# Altium schematic sheet MSC.SchDoc: MSC
size A4; Revision: Rev A; SheetNumber: 2; SheetTotal: 3
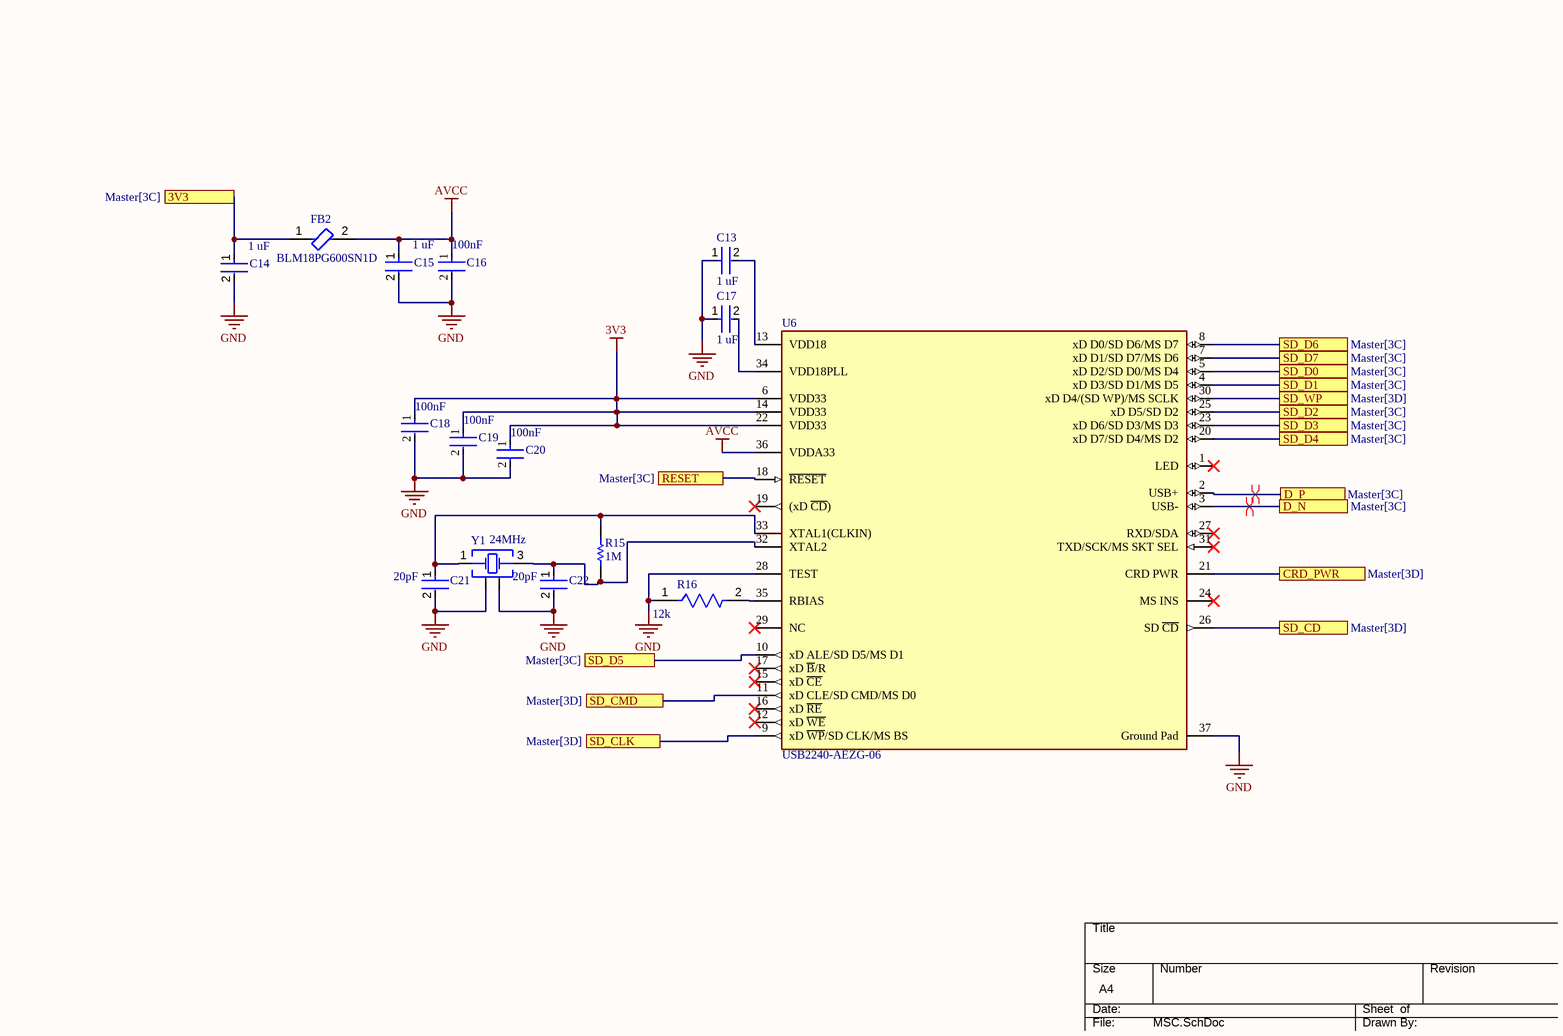
[diagram p0: MSC.SchDoc]

## Parts
C13  value 1 uF  [FP-CC0603-DA-MFG]  (hidden comment: CC0603KRX7R7BB105)
C14  value 1 uF  [FP-CC0603-DA-MFG]  (hidden comment: CC0603KRX7R7BB105)
C15  value 1 uF  [FP-CC0603-DA-MFG]  (hidden comment: CC0603KRX7R7BB105)
C16  Capacitance: 100nF  [FP-GRM155-0_05-MFG]  (hidden comment: GRM155R71C104KA88J)
C17  value 1 uF  [FP-CC0603-DA-MFG]  (hidden comment: CC0603KRX7R7BB105)
C18  Capacitance: 100nF  [FP-GRM155-0_05-MFG]  (hidden comment: GRM155R71C104KA88J)
C19  Capacitance: 100nF  [FP-GRM155-0_05-MFG]  (hidden comment: GRM155R71C104KA88J)
C20  Capacitance: 100nF  [FP-GRM155-0_05-MFG]  (hidden comment: GRM155R71C104KA88J)
C21  value 20pF  [FP-GJM033-0_03-IPC_A]  (hidden comment: GJM0335C1E200FB01D)
C22  value 20pF  [FP-GJM033-0_03-IPC_A]  (hidden comment: GJM0335C1E200FB01D)
FB2  BLM18PG600SN1D  [FP-BLM18-0_15-t0_8-IPC_B]
R15  1M  [RESC1608X55X25LL10T15]
R16  Resistance: 12k  [FP-RMCF0603-IPC_C]  (hidden comment: RMCF0603FT12K0)
U6  USB2240-AEZG-06  [FP-36QFN-4106-6x6B-MFG]
Y1  Frequency: 24MHz  [WE-XTAL_CFPX-180]  (hidden comment: 830035266)

## Ports
3V3 (see Master[3C]), CRD_PWR (see Master[3D]), D_N (see Master[3C]), D_P (see Master[3C]), RESET (see Master[3C]), SD_CD (see Master[3D]), SD_CLK (see Master[3D]), SD_CMD (see Master[3D]), SD_D0 (see Master[3C]), SD_D1 (see Master[3C]), SD_D2 (see Master[3C]), SD_D3 (see Master[3C]), SD_D4 (see Master[3C]), SD_D5 (see Master[3C]), SD_D6 (see Master[3C]), SD_D7 (see Master[3C]), SD_WP (see Master[3D])

## Nets
3V3: C18.1 C19.1 C20.1 U6.6(VDD33) U6.14(VDD33) U6.22(VDD33)
AVCC: C15.1 C16.1 FB2.2 U6.36(VDDA33)
GND: C13.1 C14.2 C15.2 C16.2 C17.1 C18.2 C19.2 C20.2 C21.2 C22.2 R16.1 U6.28(TEST) U6.37(Ground_Pad) Y1.2(GND&Lid) Y1.4(GND&Lid)
3V3: C14.1 FB2.1 ; port 3V3  [a separate net that carries the same name]
CRD_PWR: U6.21(CRD_PWR) ; port CRD_PWR
D_N: U6.3(USB-) ; port D_N
D_P: U6.2(USB+) ; port D_P
RESET: U6.18(~{RESET}) ; port RESET
SD_CD: U6.26(SD_~{CD}) ; port SD_CD
SD_CLK: U6.9(xD_~{WP}/SD_CLK/MS_BS) ; port SD_CLK
SD_CMD: U6.11(xD_CLE/SD_CMD/MS_D0) ; port SD_CMD
SD_D0: U6.5(xD_D2/SD_D0/MS_D4) ; port SD_D0
SD_D1: U6.4(xD_D3/SD_D1/MS_D5) ; port SD_D1
SD_D2: U6.25(xD_D5/SD_D2) ; port SD_D2
SD_D3: U6.23(xD_D6/SD_D3/MS_D3) ; port SD_D3
SD_D4: U6.20(xD_D7/SD_D4/MS_D2) ; port SD_D4
SD_D5: U6.10(xD_ALE/SD_D5/MS_D1) ; port SD_D5
SD_D6: U6.8(xD_D0/SD_D6/MS_D7) ; port SD_D6
SD_D7: U6.7(xD_D1/SD_D7/MS_D6) ; port SD_D7
SD_WP: U6.30(xD_D4/(SD_WP)/MS_SCLK) ; port SD_WP
NetC13_2: C13.2 U6.13(VDD18)
NetC17_2: C17.2 U6.34(VDD18PLL)
NetC21_1: C21.1 R15.1 U6.33(XTAL1(CLKIN)) Y1.1(Crystal)
NetC22_1: C22.1 R15.2 U6.32(XTAL2) Y1.3(Crystal)
NetR16_2: R16.2 U6.35(RBIAS)

Not connected (* = marked no-connect by the designer): U6 1(LED)* 12(xD_~{WE})* 15(xD_~{CE})* 16(xD_~{RE})* 17(xD_~{B}/R)* 19((xD_~{CD}))* 24(MS_INS)* 27(RXD/SDA)* 29(NC)* 31(TXD/SCK/MS_SKT_SEL)*

## Layout directives
differential pair: D_N, D_P

## Notes on the sheet
- THIS DOCUMENT AND THE DATA DISCLOSED HEREIN OR
- HEREWITH IS THE PROPERTY OF ALTIUM LIMITED AND MAY
- DWG NO:
- REVISION
- REV:
- DESCRIPTION
- DATE
- APPROVED
- BE FREELY DISTRIBUTED IN WHOLE. NO RIGHTS ARE
- RESERVED OR EXPRESS OR IMPLIED WARANTEE GIVEN.
- ENG:
- APPROVALS
- PROJECT
- DSN:
- CHK:
- REFERENCE DOCUMENTS
- PROJECT REVISION:
- TITLE
- DOCUMENT REVISION:
- DESIGN ITEM:
- BOM:
- FAB DWG:
- PCB DWG:
- ASSY DWG:
- SCALE:
- A3
- SIZE
- CAGE CODE
- FILE NAME
- DWG NO.
- SHEET
- OF
- REV

## Library data of the parts
C13-C15 C17 = CMP-03422-000924-1: CAP CER 1UF 16V X7R 0603; Manufacturer: YAGEO; Tolerance: 0.1; Temperature Coefficient: 15%; Material: Ceramic; Package: CC0603-DA; RoHS: TRUE; Device Class L2: Capacitors; Temperature Characteristic: X7R; Temperature: -55°C to +125°C; Temperature Range Low: -55°C; Automotive: No; ComponentLink2Description: Datasheet; Lead Free: Yes; Capacitance: 1 uF; ComponentLink2URL: http://www.yageo.com/documents/recent/UPY-GPHC_X7R_6.3V-to-50V_18.pdf; Device Class L1: Passive Components; Voltage: 16 V; Octopart: https://octopart.com/cc0603krx7r7bb105-yageo-42271928; Category: Cap; Digikey Description: CAP CER 1UF 16V X7R 0603; Footprint Url: http://www.yageo.com/exep/pages/download/literatures/UPY-C_GEN_24.pdf; Height: 0.9mm; Manufacturer Part Number: CC0603KRX7R7BB105; Voltage Rating: 16 V; Temperature Range High: +125°C; Mouser Description: Multilayer Ceramic Capacitor, CC Series, 1 - F, - 10%, X7R, 16 V, 0603 [1608 Metric]; Device Class L3: Ceramic Capacitors
C16 C18-C20 = CMP-2008-03928-2: NexarPartId: 9223238; Manufacturer Lifecycle Status: NRND; Voltage: 16V; Tolerance: 10%; Dielectric: X7R; Material: Ceramic; Schedule B: 8532240020, 8532240020; Mount: Surface Mount; Case/Package: 0402; Case Code (Imperial): 0402; Min Operating Temperature: -55°C; Length: 1mm; Voltage Rating (DC): 16V; Depth: 500µm; Lead Free: Lead Free; Max Operating Temperature: 125°C; Case Code (Metric): 1005; Radiation Hardening: No; Height: 550µm; Voltage Rating: 16V; Packaging: Cut Tape; RoHS: Compliant; Width: 500µm; Number of Pins: 2; REACH SVHC: No SVHC; Termination: SMD/SMT; Thickness: 500µm
C21 C22 = CMP-06035-050874-1: Ceramic Capacitor 20pF ±1% 25V C0G 0201 (0603 Metric)
FB2 = CMP-0686-00575-3: Chip Ferrite Bead, 0603, 60Ω @ 100MHz, 0.1Ω, , 1A; ESR (Equivalent Series Resistance): 60R; Number of Lines: 1; Material: Steel; Tolerance: 25%; Shielding: Unshielded; Current Rating: 500mA; Resistance: 100mR; Package Quantity: 1; Termination: SMD/SMT; Lead Free: Lead Free; Max Operating Temperature: 125°C; Number of Circuits: 1; Length: 1.6mm; Min Operating Temperature: -55°C; Case Code (Metric): 1608; Max DC Current: 500mA; REACH SVHC: No SVHC; Frequency: 100MHz; Number of Pins: 2; RoHS Compliant: Yes; Height: 0.8mm; Depth: 0.8mm; Width: 0.8mm; Test Frequency: 100MHz; Case/Package: 0603; Impedance: 60R; Max Current Rating: 500mA; Packaging: Tape and Reel; DC Resistance (DCR): 100mR; Case Code (Imperial): 0603; Core Material: Ferrite
R15 = CMP-1659-00056-1: Chip Resistor, 1 MOhm, +/- 1%, 100 mW, -55 to 155 degC, 0603 (1608 Metric), RoHS, Tape and Reel; Voltage Rating (DC): 25 V; Tolerance: 20%; Case\Package: Radial; Capacitance: 1 mF; Min Operating Temperature: -40 degC; PackageDescription: 2-Pin Surface Mount Device, Body 1.6 x 0.8 mm; ComponentLink1Description: Manufacturer URL; Radiation Hardening: No; DatasheetVersion: Rev. 4, 02/2016; REACH SVHC: No SVHC; Length: 20 mm; Max Operating Temperature: 85 degC; Diameter: 10 mm; Packaging: Bulk; Package Quantity: 200; PackageReference: 0603; Mount: Through Hole; ComponentLink1URL: http://www.yageo.com/; ComponentLink2URL: http://www.yageo.com/documents/recent/PYu-RC_Group_51_RoHS_L_04.pdf; ComponentLink2Description: Datasheet; Width: 0 inch; Lead Pitch: 5 mm; RoHSCompliant: true; Voltage Rating: 25 V; Height: 20 mm
R16 = CMP-26527-001326-1: 12kΩ ±1% 0.1W 0603 Thick Film Chip Resistor AEC-Q200 compliant; Temperature Coefficient: 100ppm/°C; Max Power Dissipation: 100mW; Lead Free: Lead Free; Case Code (Metric): 1608; Features: Automotive AEC-Q200; Length: 0.061inch; Radiation Hardening: No; Size Code: 0603; Mount: Surface Mount; Series: RMCF; Width: 0.031inch; Tolerance: 1%; Case Code (Imperial): 0603; Case/Package: 0603; Resistor Type: Thick Film; Min Operating Temperature: -55°C; Packaging: Tape and Reel; Height: 0.022inch; Contact Plating: Tin; Number of Terminations: 2; RoHS Compliant: Yes; Power Rating: 100mW; Max Operating Temperature: 155°C
U6 = CMP-06284-000093-1: IC INTERFACE SPECIALIZED 36QFN; Manufacturer: Murata; Manufacturer Part Number: GRM188R71H104KA93D; Operating Supply Current: 135mA; Max Supply Voltage: 3.6V; Data Rate: 35Mbps; Operating Supply Voltage: 3.3V; Number of Transceivers: 1; Min Supply Voltage: 3V; Interface: SPI; Dielectric Material: Ceramic; Value: 100nF; Multilayer: Yes; Tolerance  (fill in as +-): 10%; Rated DC Voltage (URdc): 50V; Temperature Characteristics Code: X7R; Length: 6.15mm; Width: 6.15mm; Lead Free: Lead Free; Number of Pins: 36; Series: -; Case/Package: QFN; RoHS Compliant: Yes; Packaging: Tray; Mount: Surface Mount; Package Quantity: 490; Min Operating Temperature: 0°C; Height: 0.95mm; Max Operating Temperature: 70°C; Reach SVHC Compliant: Yes; Supplier: Arrow Electronics; Supplier Part Number: GRM188R71H104KA93D; RoHS: Yes; Category: Ceramic Capacitors; Stock: 200000; Pricing: 8000=0.0106, 12000=0.0105, 20000=0.0104, 24000=0.0103, 100000=0.0096 (USD); Mounting Technology: Surface Mount; Pins: 2; Package Shape: Rectangular; Terminal Finish: Nickel; JESD-609 Code: e3; Capacitor Type: Ceramic; Package Style: SMTMeter; Tolerance (fill in as +-): 10%; Termination: Wraparound; ComponentLink1URL: https://datasheet.ciiva.com:443/pdfs/VipMasterIC/IC/MURE/MURE-S-A0004386736/MURE-S-A0004388063-1.pdf?src-supplier=IHS+Markit; ComponentLink1Description: https://datasheet.ciiva.com:443/pdfs/VipMasterIC/IC/MURE/MURE-S-A0004386736/MURE-S-A0004388063-1.pdf?src-supplier=IHS+Markit; ComponentLink2URL: https://datasheet.ciiva.com/11786/0900766b807a1cab-11786047.pdf?src-supplier=Rs; ComponentLink2Description: https://datasheet.ciiva.com/11786/0900766b807a1cab-11786047.pdf?src-supplier=Rs; ComponentLink3URL: https://datasheet.ciiva.com/19467/1857604-19467681.pdf?src-supplier=Jameco; ComponentLink3Description: https://datasheet.ciiva.com/19467/1857604-19467681.pdf?src-supplier=Jameco; ComponentLink4URL: https://datasheet.ciiva.com/29201/451744-da-01-en-vs-kondensator-0603-29201904.pdf?src-supplier=Conrad; ComponentLink4Description: https://datasheet.ciiva.com/29201/451744-da-01-en-vs-kondensator-0603-29201904.pdf?src-supplier=Conrad; ComponentLink5URL: https://datasheet.ciiva.com/131/partnumbering-e-01-131738.pdf?src-supplier=Digikey; ComponentLink5Description: https://datasheet.ciiva.com/131/partnumbering-e-01-131738.pdf?src-supplier=Digikey; ComponentLink6URL: https://datasheet.ciiva.com/131/partnumbering-e-01-131739.pdf?src-supplier=Digikey; ComponentLink6Description: https://datasheet.ciiva.com/131/partnumbering-e-01-131739.pdf?src-supplier=Digikey; ComponentLink7URL: https://datasheet.ciiva.com/131/partnumbering-e-01-131740.pdf?src-supplier=Digikey; ComponentLink7Description: https://datasheet.ciiva.com/131/partnumbering-e-01-131740.pdf?src-supplier=Digikey; ComponentLink8URL: https://datasheet.ciiva.com/14116/nmgrm-data-en-14116602.pdf?src-supplier=Distrelec; ComponentLink8Description: https://datasheet.ciiva.com/14116/nmgrm-data-en-14116602.pdf?src-supplier=Distrelec; ComponentLink9URL: https://datasheet.ciiva.com/48436/nmgrm-data-en-48436667.pdf?src-supplier=Distrelec; ComponentLink9Description: https://datasheet.ciiva.com/48436/nmgrm-data-en-48436667.pdf?src-supplier=Distrelec; ComponentLink10URL: https://datasheet.ciiva.com/28534/4360-28534245.pdf?src-supplier=Element14; ComponentLink10Description: https://datasheet.ciiva.com/28534/4360-28534245.pdf?src-supplier=Element14; ComponentLink11URL: https://datasheet.ciiva.com/7937/1747470-7937658.pdf?src-supplier=Element14; ComponentLink11Description: https://datasheet.ciiva.com/7937/1747470-7937658.pdf?src-supplier=Element14; ComponentLink12URL: https://datasheet.ciiva.com/7937/4360-7937659.pdf?src-supplier=Element14; ComponentLink12Description: https://datasheet.ciiva.com/7937/4360-7937659.pdf?src-supplier=Element14; ComponentLink13URL: https://datasheet.ciiva.com:443/pdfs/VipMasterIC/IC/KEME/KEME-S-A0008991665/KEME-S-A0008991665-1.pdf?src-supplier=IHS+Markit; ComponentLink13Description: https://datasheet.ciiva.com:443/pdfs/VipMasterIC/IC/KEME/KEME-S-A0008991665/KEME-S-A0008991665-1.pdf?src-supplier=IHS+Markit
Y1 = CMP-03913-116876455-1: 830035266 WE-XTAL Quartz Crystal; Length: 3.2mm; NexarPartId: 116876455; Width: 2.5mm; Height: 800µm; Max Operating Temperature: 60°C; Min Operating Temperature: -10°C